# Altium project Motor control board.PrjPcb (part 2 of 2)
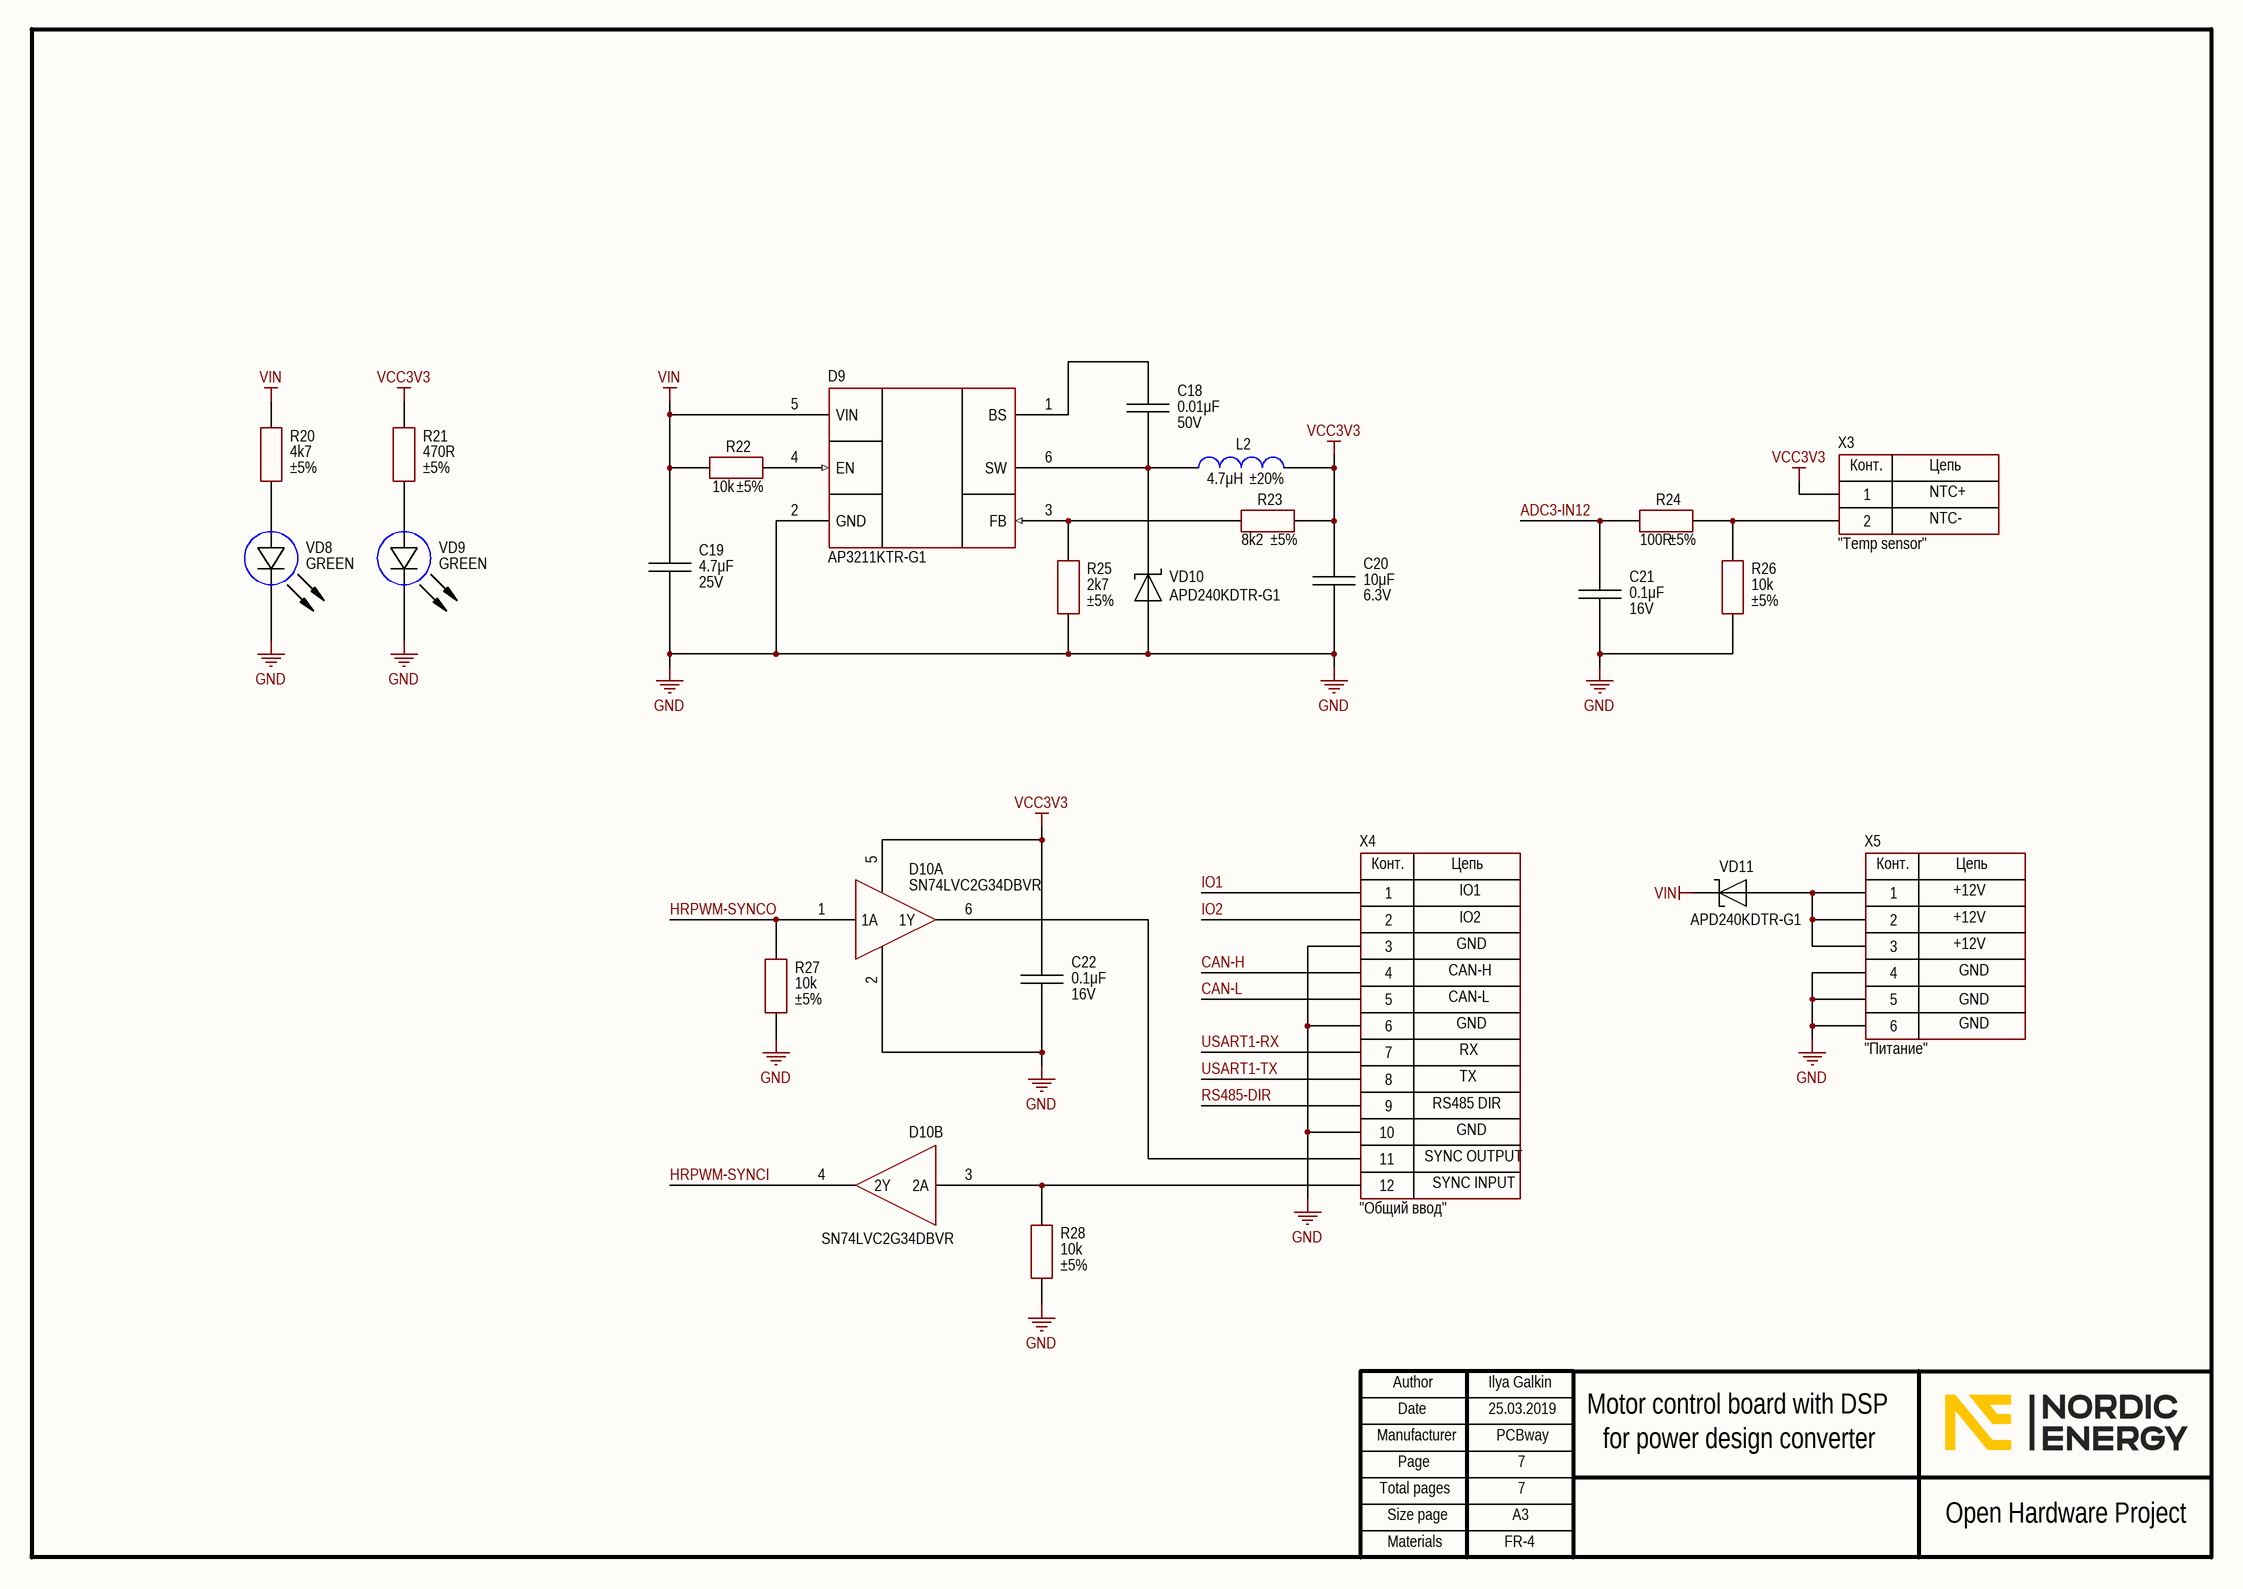
[diagram p7: Power and system. Page 7.SchDoc]

## Nets that join several sheets
GND: Main MCU. Page 1 (30 pins), Protection channel A. Page 2 (18 pins), Protection channel B. Page 3 (18 pins), Protection channel C. Page 4 (18 pins), Protection channel D. Page 5 (18 pins), USB and CAN. Page 6 (6 pins), Power and system. Page 7 (19 pins)
VCC3V3: Main MCU. Page 1 (19 pins), Protection channel A. Page 2 (14 pins), Protection channel B. Page 3 (14 pins), Protection channel C. Page 4 (14 pins), Protection channel D. Page 5 (14 pins), USB and CAN. Page 6 (C39.2 C42.2 D29.8 D31.3), Power and system. Page 7 (7 pins)
ADC1-IN1: Main MCU. Page 1 (D1.12), Protection channel A. Page 2 (C14.2 R15.1)
ADC1-IN2: Main MCU. Page 1 (D1.13), Protection channel A. Page 2 (C17.2 R19.1)
ADC1-IN3: Main MCU. Page 1 (D1.14), Protection channel B. Page 3 (C24.2 R31.1)
ADC1-IN4: Main MCU. Page 1 (D1.17), Protection channel B. Page 3 (C27.2 R35.1)
ADC2-IN6: Main MCU. Page 1 (D1.8), Protection channel C. Page 4 (C29.2 R38.1)
ADC2-IN7: Main MCU. Page 1 (D1.9), Protection channel C. Page 4 (C32.2 R42.1)
ADC2-IN8: Main MCU. Page 1 (D1.10), Protection channel D. Page 5 (C34.2 R45.1)
ADC2-IN9: Main MCU. Page 1 (D1.11), Protection channel D. Page 5 (C37.2 R49.1)
ADC3-IN12: Main MCU. Page 1 (D1.24), Power and system. Page 7 (C21.2 R24.1)
ADC-CHA1: Protection channel A. Page 2 (R15.2 VD5.3 X2.1), Protection channel B. Page 3 (R31.2 VD12.3 X6.1), Protection channel C. Page 4 (R38.2 VD15.3 X7.1), Protection channel D. Page 5 (R45.2 VD18.3 X8.1)
ADC-CHA2: Protection channel A. Page 2 (R19.2 VD7.3 X2.5), Protection channel B. Page 3 (R35.2 VD14.3 X6.5), Protection channel C. Page 4 (R42.2 VD17.3 X7.5), Protection channel D. Page 5 (R49.2 VD20.3 X8.5)
CAN2-RX: Main MCU. Page 1 (D1.58), USB and CAN. Page 6 (R57.1)
CAN2-TX: Main MCU. Page 1 (D1.59), USB and CAN. Page 6 (R56.1)
CAN-H: USB and CAN. Page 6 (D31.7 R58.2 VD22.1), Power and system. Page 7 (X4.4)
CAN-L: USB and CAN. Page 6 (D31.6 R58.1 VD22.2), Power and system. Page 7 (X4.5)
FAULT-CLR-CHA: Main MCU. Page 1 (D1.18), Protection channel A. Page 2 (D7.6 R16.2)
FAULT-CLR-CHB: Main MCU. Page 1 (D1.19), Protection channel B. Page 3 (D15.6 R32.2)
FAULT-CLR-CHC: Main MCU. Page 1 (D1.20), Protection channel C. Page 4 (D21.6 R39.2)
FAULT-CLR-CHD: Main MCU. Page 1 (D1.21), Protection channel D. Page 5 (D27.6 R46.2)
FAULT-INA: Protection channel A. Page 2 (D8.2 R18.1 X2.4), Protection channel B. Page 3 (X6.4), Protection channel C. Page 4 (X7.4), Protection channel D. Page 5 (X8.4)
HRPWM-CHA1: Main MCU. Page 1 (D1.42), Protection channel A. Page 2 (D3.1 D6.1 R13.2)
HRPWM-CHA2: Main MCU. Page 1 (D1.43), Protection channel A. Page 2 (D3.6 D6.2 R14.1)
HRPWM-CHB1: Main MCU. Page 1 (D1.44), Protection channel B. Page 3 (D11.1 D14.1 R29.2)
HRPWM-CHB2: Main MCU. Page 1 (D1.45), Protection channel B. Page 3 (D11.6 D14.2 R30.1)
HRPWM-CHC1: Main MCU. Page 1 (D1.34), Protection channel C. Page 4 (D17.1 D20.1 R36.2)
HRPWM-CHC2: Main MCU. Page 1 (D1.35), Protection channel C. Page 4 (D17.6 D20.2 R37.1)
HRPWM-CHD1: Main MCU. Page 1 (D1.36), Protection channel D. Page 5 (D23.1 D26.1 R43.2)
HRPWM-CHD2: Main MCU. Page 1 (D1.37), Protection channel D. Page 5 (D23.6 D26.2 R44.1)
HRPWM-SYNCI: Main MCU. Page 1 (D1.26), Power and system. Page 7 (D10.4)
HRPWM-SYNCO: Main MCU. Page 1 (D1.25), Power and system. Page 7 (D10.1 R27.1)
IO1: Main MCU. Page 1 (D1.38), Power and system. Page 7 (X4.1)
IO2: Main MCU. Page 1 (D1.39), Power and system. Page 7 (X4.2)
RS485-DIR: Main MCU. Page 1 (D1.55), Power and system. Page 7 (X4.9)
USART1-RX: Main MCU. Page 1 (D1.23), USB and CAN. Page 6 (R51.2), Power and system. Page 7 (X4.7)
USART1-TX: Main MCU. Page 1 (D1.22), USB and CAN. Page 6 (R50.2), Power and system. Page 7 (X4.8)